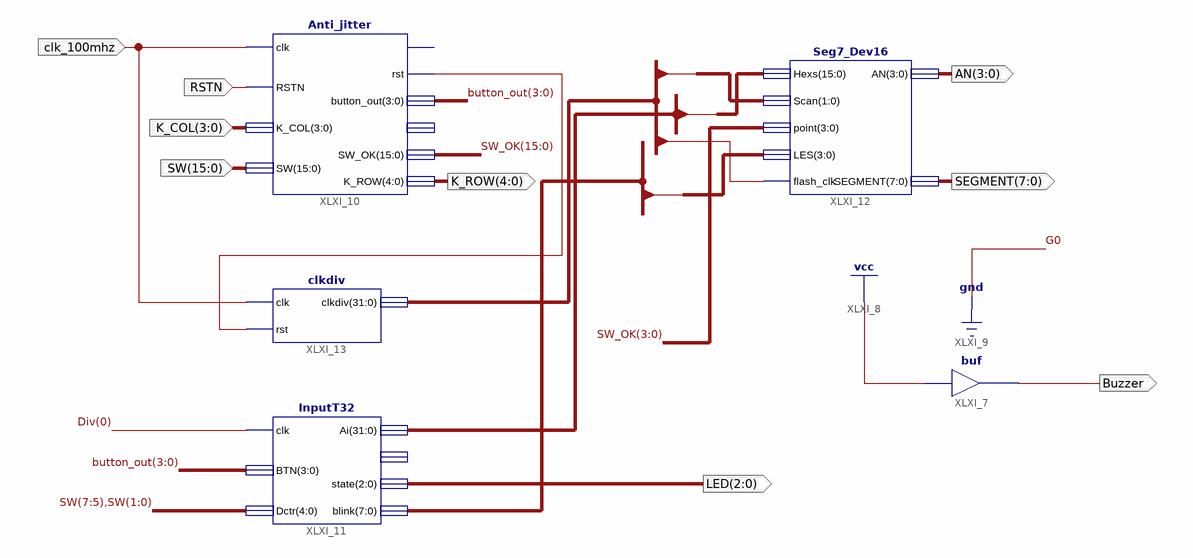
[diagram p0: schematic sheet 1]
// Xilinx ISE schematic I2Disp.sch (kintex7) as structural Verilog: 5 symbols, 9 ports
module I2Disp (
  input  RSTN,
  input  [3:0] K_COL,
  input  [15:0] SW,
  input  clk_100mhz,
  output [4:0] K_ROW,
  output [2:0] LED,
  output [3:0] AN,
  output [7:0] SEGMENT,
  output Buzzer
);

  wire XLXN_6;
  wire [3:0] button_out;
  wire [7:0] blink;
  wire [15:0] SW_OK;
  wire [31:0] Ai, Div;

  buf XLXI_7 (Buzzer, 1'b1);
  Anti_jitter XLXI_10 (
    .clk(clk_100mhz), .RSTN(RSTN), .K_COL(K_COL), .SW(SW), .rst(XLXN_6), .button_out(button_out),
    .SW_OK(SW_OK), .K_ROW(K_ROW));  // open: CR, button_pulse
  InputT32 XLXI_11 (
    .clk(Div[0]), .BTN(button_out), .Dctr({SW[7:5], SW[1:0]}), .Ai(Ai), .state(LED), .blink(blink));  // open: Bi
  Seg7_Dev16 XLXI_12 (
    .Hexs(Ai[15:0]), .Scan(Div[18:17]), .point(SW_OK[3:0]), .LES(blink[3:0]), .flash_clk(Div[25]), .AN(AN),
    .SEGMENT(SEGMENT));
  clkdiv XLXI_13 (.clk(clk_100mhz), .rst(XLXN_6), .clkdiv(Div));
endmodule
